# Altium project PCB_Workshop.PrjPcb
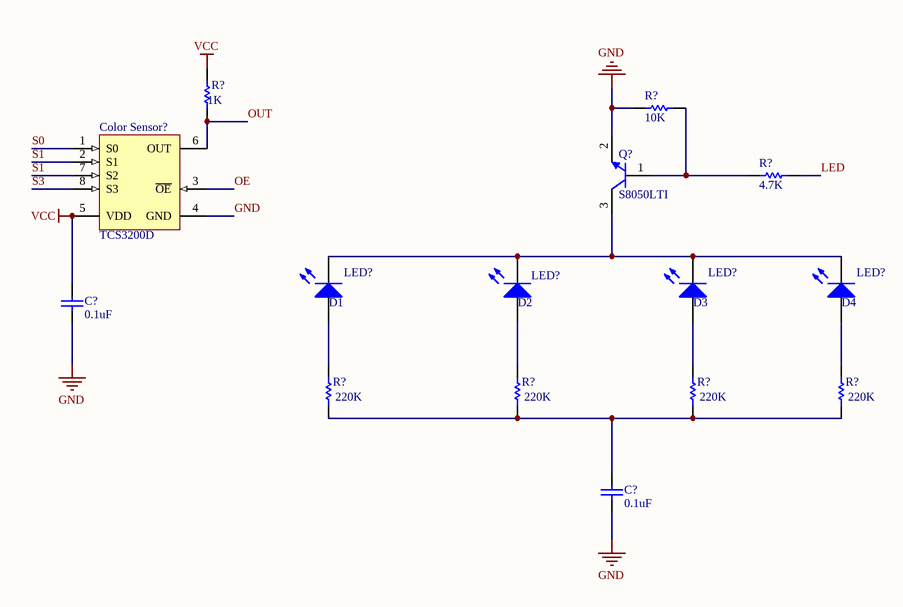
[diagram p0: PCB_workshop.SchDoc]
1 sheet, 15 parts. Net scope: global (net labels, ports and power ports of the same name join across sheets).

## Sheet PCB_workshop.SchDoc
size A4; SheetNumber: 1; SheetTotal: 1

### Parts
(Parts that share a designator on the sheet are numbered #1, #2 ... from top to bottom, then left to right.)
C?#1  value 0.1uF  (hidden comment: Capacitor)
C?#2  value 0.1uF  (hidden comment: Capacitor)
Color_Sensor?  TCS3200D  [AMS-D-8-4900X3900DE_L]
LED?#1  D1
LED?#2  D2
LED?#3  D3
LED?#4  D4
Q?  S8050LTI  [ONSC-SC-75-3-463-01_V]
R?#1  R6: 10K  (hidden comment: Resistor)
R?#2  value 1K  (hidden comment: Resistor)
R?#3  R6: 4.7K  (hidden comment: Resistor)
R?#4  value 220K  (hidden comment: Resistor)
R?#5  value 220K  (hidden comment: Resistor)
R?#6  value 220K  (hidden comment: Resistor)
R?#7  value 220K  (hidden comment: Resistor)

### Nets
GND: C?#1.1 C?#2.1 Color_Sensor?.4(GND) Q?.2(E) R?#1.2
VCC: C?#1.2 Color_Sensor?.5(VDD) R?#2.2
LED: R?#3.1
OE: Color_Sensor?.3(~{OE})
OUT: Color_Sensor?.6(OUT) R?#2.1
S0: Color_Sensor?.1(S0)
S1: Color_Sensor?.2(S1) Color_Sensor?.7(S2)
S3: Color_Sensor?.8(S3)
NetC?#2_2: C?#2.2 R?#4.1 R?#5.1 R?#6.1 R?#7.1
NetLED?#1_1: LED?#1.1(A) R?#4.2
NetLED?#1_2: LED?#1.2(K) LED?#2.2(K) LED?#3.2(K) LED?#4.2(K) Q?.3(C)
NetLED?#2_1: LED?#2.1(A) R?#5.2
NetLED?#3_1: LED?#3.1(A) R?#6.2
NetLED?#4_1: LED?#4.1(A) R?#7.2
NetQ?_1: Q?.1(B) R?#1.1 R?#3.2

### Library data of the parts
C?#1 C?#2 = Capacitor: SimulationGenericComponent: True
Color_Sensor? = CMP-0550-00021-2: Programmable Color Light-to-Frequency Converter, 2.7 to 5.5 V, D-8, Pb-Free, Reel; Manufacturer: AMS; Supply Voltage (V): 2.7-5.5; Color Sensor Channels: RGBC; PackageReference: D-8; Mounting Technology: Surface Mount; PackageDescription: 8-Pin Small Outline Integrated Circuit, 4.9 x 3.9 mm Body, 1.27 mm Pitch; DatasheetVersion: TAOS099A; ComponentLink2URL: http://www.ams.com/eng/content/download/250259/976005/142755; ComponentLink1Description: Manufacturer URL; ComponentLink1URL: www.ams.com; ComponentLink2Description: Datasheet; PackageVersion: TAOS099A, 08/2011; PartNumber: TCS3200D
LED?#1-LED?#4 = LED: Light-Emitting Diode; AF: 1; BV: 0; BV_MAX: 1e99; EG: 1.11; FC: 0.5; IBV: 0.001; IS: 1e-14; MJSW: 0.33; NTUN: 30; TNOM: 27; XTI: 3; SimulationGenericComponent: True; CJO: 0; CJP: 0; CTA: 0; CTP: 0; FCS: 0.5; FV_MAX: 1e99; IKF: 0; IKR: 0; ISR: 1e-14; JSW: 0; JTUN: 0; JTUNSW: 0; KEG: 1; KF: 0; LEVEL: 1; N: 1; NBV: 1; NR: 1; NS: 1; PHP: 1; RS: 0; TCV: 0; TLEV: 0; TLEVC: 0; TM1: 0; TM2: 0; TPB: 0; TPHP: 0; TRS: 0; TRS2: 0; TT: 0; TTT1: 0; TTT2: 0; VJ: 1; XTITUN: 3
Q? = CMP-1048-00420-1: General Purpose Transistor, NPN Silicon, 3-Pin SC-75, Pb-Free, Tape and Reel; PartNumber: MMBT3904TT1G; Manufacturer: On Semiconductor; IC Continuous (A): 0.2; fT Min (MHz): 300; ComponentLink3URL: http://www.onsemi.com/pub_link/Collateral/463-01.PDF; DatasheetVersion: Rev. 5; RoHS: TRUE; Mounting Technology: Surface Mount; ComponentLink1URL: http://www.onsemi.com/; ComponentLink3Description: Package Specification; PackageReference: SC-75-3-463-01; Polarity: NPN; ComponentLink2Description: Datasheet; PackageVersion: Rev. F, 07/2005; ComponentLink2URL: http://www.onsemi.cn/pub_link/Collateral/MMBT3904TT1-D.PDF; ComponentLink1Description: Manufacturer URL; PackageDescription: 3-Pin Small Outline Transistor, Body 1.6 x 0.8 mm, Pitch 0.5 mm; Packing: Tape and Reel
R?#1-R?#7 = Resistor: TC1: 0; SimulationGenericComponent: True; TC2: 0